# EAGLE design zigduino-v4 (EAGLE 5.10)
BOM: INCLUDE; COLOR: RED; DNP: T; PARTNO: 961206-6404-AR; VOLT: 40V
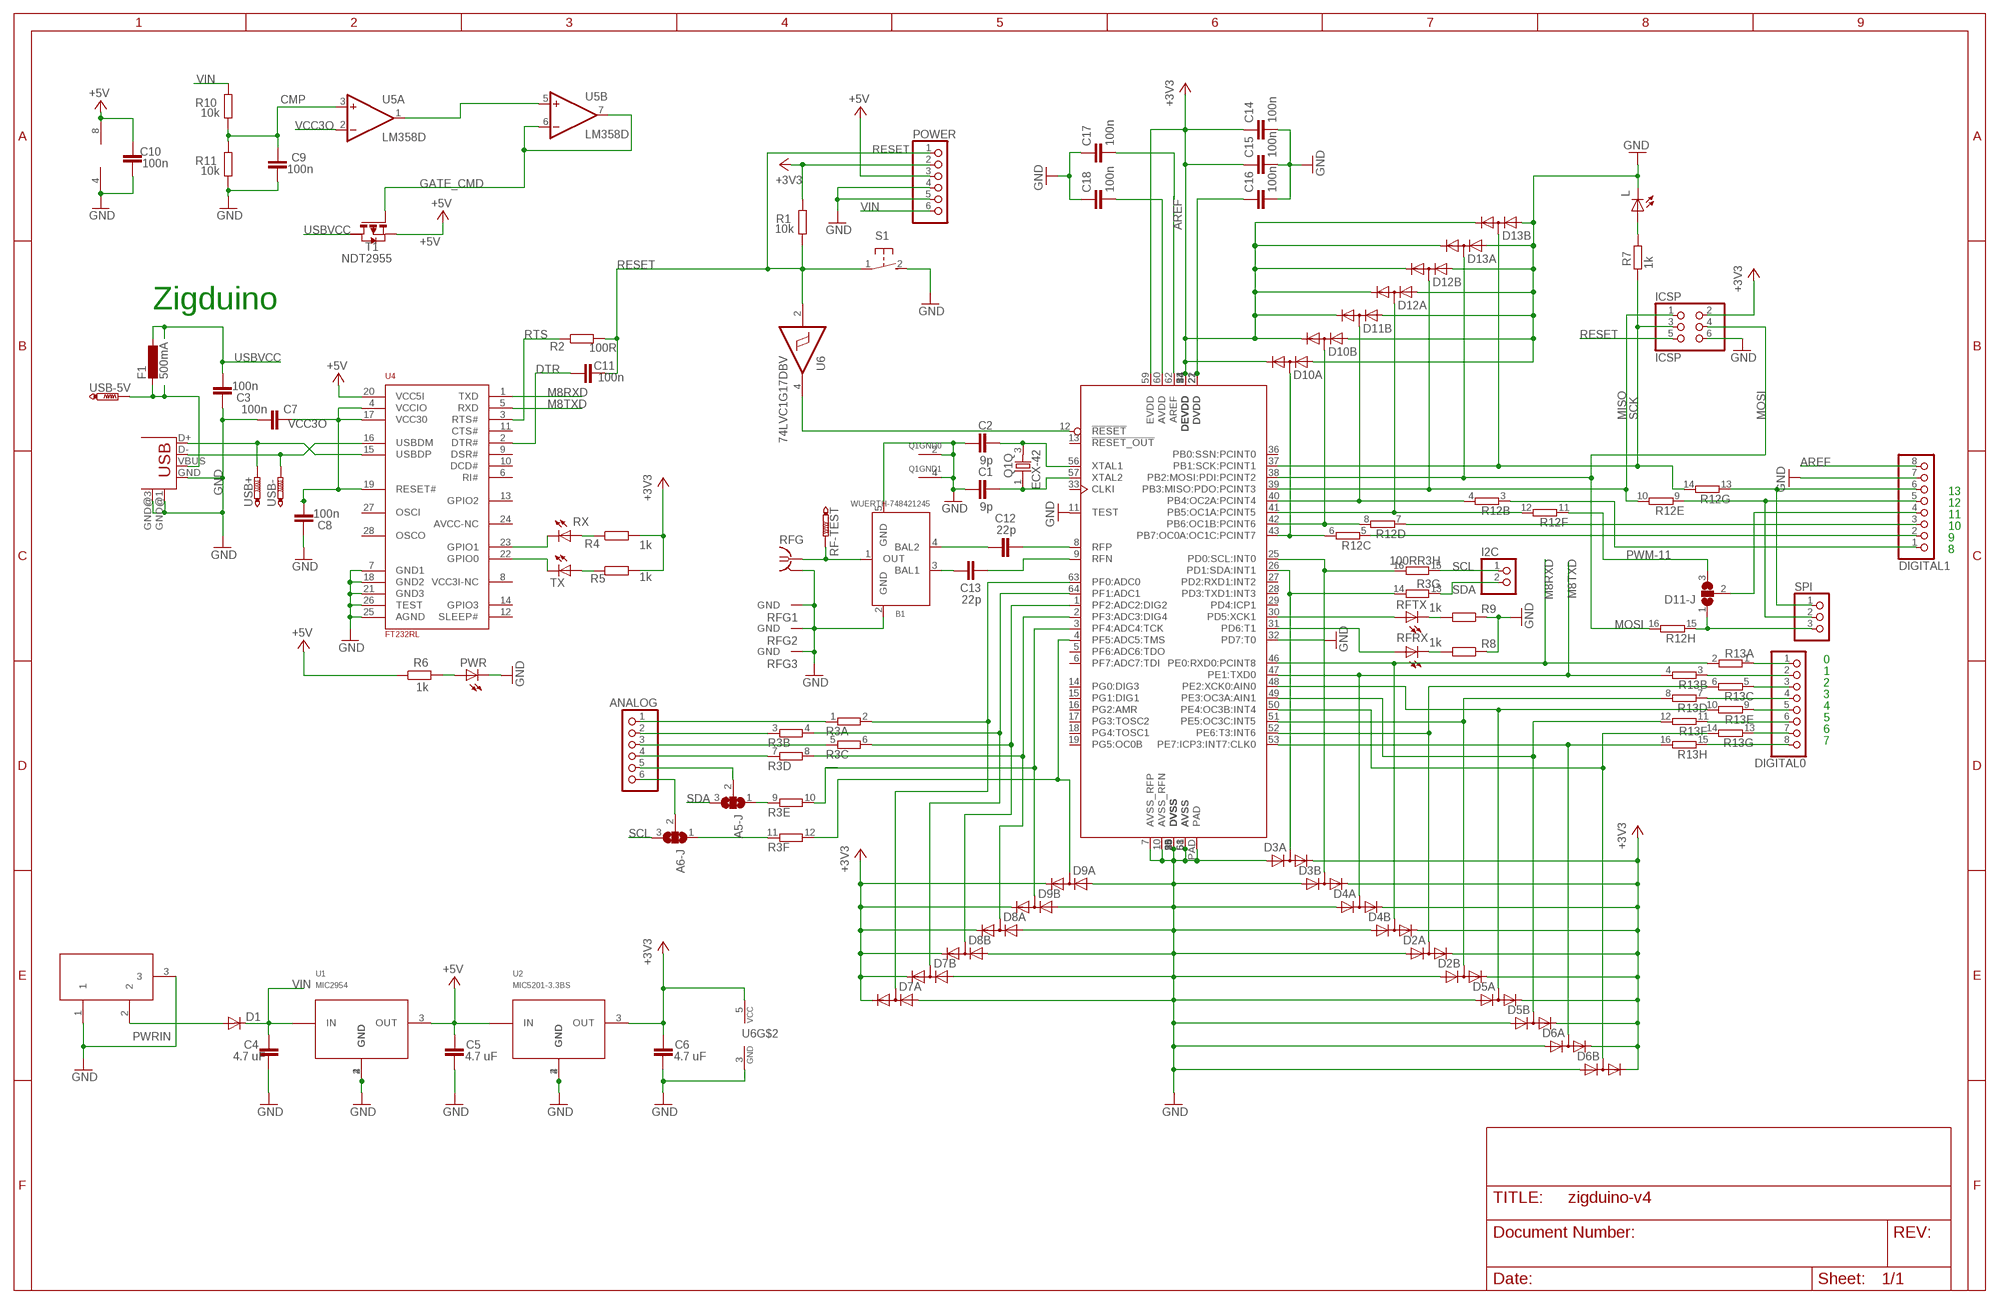
[diagram p0: schematic, sheet 1]

## Parts
A5-J  SJ2W  [SJ_2]
A6-J  SJ2W  [SJ_2]
ANALOG  PINHD-1X6  [1X06]
B1  WUERTH-748421245  [WURTH-BALUN]
C1  9p  C-EUC0603  [C0603]
C2  9p  C-EUC0603  [C0603]
C3  100n  C-EUC0603  [C0603]
C4  4.7 uF  C-EUC1206  [C1206]
C5  4.7 uF  C-EUC1206  [C1206]
C6  4.7 uF  C-EUC1206  [C1206]
C7  100n  C-EUC0603  [C0603]
C8  100n  C-EUC0603  [C0603]
C9  100n  C-EUC0603  [C0603]
C10  100n  C-EUC0603  [C0603]
C11  100n  C-EUC0603  [C0603]
C12  22p  C-EUC0603  [C0603]
C13  22p  C-EUC0603  [C0603]
C14  100n  C-EUC0603  [C0603]
C15  100n  C-EUC0603  [C0603]
C16  100n  C-EUC0603  [C0603]
C17  100n  C-EUC0603  [C0603]
C18  100n  C-EUC0603  [C0603]
D1  DIODE-SMB  [SMB]
D2  SD103ASDM  [SOT26]
D3  SD103ASDM  [SOT26]
D4  SD103ASDM  [SOT26]
D5  SD103ASDM  [SOT26]
D6  SD103ASDM  [SOT26]
D7  SD103ASDM  [SOT26]
D8  SD103ASDM  [SOT26]
D9  SD103ASDM  [SOT26]
D10  SD103ASDM  [SOT26]
D11  SD103ASDM  [SOT26]
D11-J  SJ2W  [SJ_2]
D12  SD103ASDM  [SOT26]
D13  SD103ASDM  [SOT26]
DC-PWR  DC21MMX  [DC-21MM]
DIGITAL0  PINHD-1X8  [1X08]
DIGITAL1  PINHD-1X8  [1X08]
F1  500mA  L-EUL1812  [L1812]
I2C  PINHD-1X2  [1X02]
ICSP  ICSP  PINHD-2X3  [2X03]
L  LEDCHIP-LED0603  [CHIP-LED0603]
POWER  PINHD-1X6  [1X06]
PWR  LEDCHIP-LED0603  [CHIP-LED0603]
Q1  ECX-42  [ECX-42]
R1  10k  R-EU_R0603  [R0603]
R2  100R  R-EU_R0603  [R0603]
R3  100R  8R-NCTS742C163  [CTS742C163-RES]
R4  1k  R-EU_R0603  [R0603]
R5  1k  R-EU_R0603  [R0603]
R6  1k  R-EU_R0603  [R0603]
R7  1k  R-EU_R0603  [R0603]
R8  1k  R-EU_R0603  [R0603]
R9  1k  R-EU_R0603  [R0603]
R10  10k  R-EU_R0603  [R0603]
R11  10k  R-EU_R0603  [R0603]
R12  100R  8R-NCTS742C163  [CTS742C163-RES]
R13  100R  8R-NCTS742C163  [CTS742C163-RES]
RF  CONNREVSMA003.062  [EDGE-RSMA]
RF-TEST  PTR1TP13SQ  [TP13SQ]
RFRX  LEDCHIP-LED0603  [CHIP-LED0603]
RFTX  LEDCHIP-LED0603  [CHIP-LED0603]
RX  LEDCHIP-LED0603  [CHIP-LED0603]
S1  B3U-1000  [B3U]
SPI  PINHD-1X3  [1X03]
T1  NDT2955  PMOSSOT223  [SOT223]
TX  LEDCHIP-LED0603  [CHIP-LED0603]
U1  MIC2954  [SOT223]
U2  MIC5201-3.3BS  [SOT223]
U3  ATMEGA128RFA1  [QFN64]
U4  FT232RL  [SSOP28]
U5  LM358D  [SO08]
U6  74LVC1G17DBV  [SOT23-5]
USB  USB-MB-S  [USB-MB-S]
USB+  PTR1TP13SQ  [TP13SQ]
USB-  PTR1TP13SQ  [TP13SQ]
USB-5V  PTR1TP13SQ  [TP13SQ]

## Nets
+3V3: C6.1 C14.1 C15.1 D2.2(A:C) D2.5(B:C) D3.2(A:C) D3.5(B:C) D4.2(A:C) D4.5(B:C) D5.2(A:C) D5.5(B:C) D6.2(A:C) D6.5(B:C) D7.2(A:C) D7.5(B:C) D8.2(A:C) D8.5(B:C) D9.2(A:C) D9.5(B:C) D10.2(A:C) D10.5(B:C) D11.5(B:C) D12.2(A:C) D12.5(B:C) D13.2(A:C) D13.5(B:C) ICSP.2 POWER.2 R1.2 R4.2 R5.2 U2.3(OUT) U3.23(DEVDD) U3.34(DEVDD) U3.44(DEVDD) U3.54(DEVDD) U3.59(EVDD) U6.5(VCC)
+5V [usbvcc]: C5.1 C10.2 POWER.3 R6.1 T1.3(S) U1.3(OUT) U2.1(IN) U4.20(VCC5I) U5.8(P:V+)
AREF [aref]: C17.2 DIGITAL1.8 U3.62(AREF)
CMP: C9.2 R10.1 R11.2 U5.3(A:+IN)
DTR: C11.1 U4.2(DTR#)
GATE_CMD: T1.1(G) U5.6(B:-IN) U5.7(B:OUT)
GND [gnd]: B1.2(GND) B1.5(GND) C1.1 C2.1 C3.2 C4.2 C5.2 C6.2 C7.1 C8.2 C9.1 C10.1 C14.2 C15.2 C16.2 C17.1 C18.1 D2.3(A:A) D2.6(B:A) D3.3(A:A) D3.6(B:A) D4.3(A:A) D4.6(B:A) D5.3(A:A) D5.6(B:A) D6.3(A:A) D6.6(B:A) D7.3(A:A) D7.6(B:A) D8.3(A:A) D8.6(B:A) D9.3(A:A) D9.6(B:A) D10.3(A:A) D10.6(B:A) D11.6(B:A) D12.3(A:A) D12.6(B:A) D13.3(A:A) D13.6(B:A) DC-PWR.1 DC-PWR.3 DIGITAL1.7 ICSP.6 L.C POWER.4 POWER.5 PWR.C Q1.2(GND0:PIN) Q1.4(GND1:PIN) R8.1 R9.1 R11.1 RF.SHIELD@0(G:GND) RF.SHIELD@1(GND) RF.SHIELD@2(GND) RF.SHIELD@3(GND) S1.2 U1.2(GND) U1.4(GND) U2.2(GND) U2.4(GND) U3.7(AVSS_RFP) U3.10(AVSS_RFN) U3.11(TEST) U3.20(DVSS) U3.24(DVSS) U3.32(PD7:T0) U3.35(DVSS) U3.45(DVSS) U3.55(DVSS) U3.58(AVSS) U3.61(AVSS) U3.PAD U4.7(GND1) U4.18(GND2) U4.21(GND3) U4.25(AGND) U4.26(TEST) U5.4(P:V-) U6.3(GND) USB.GND USB.GND@1(GND) USB.GND@3(GND)
M8RXD: D4.1(B:AC) R13.2 U3.46(PE0:RXD0:PCINT8) U4.1(TXD)
M8TXD: D4.4(A:AC) R13.4 U3.47(PE1:TXD0) U4.5(RXD)
MISO: D12.1(B:AC) ICSP.1 R12.10 U3.39(PB3:MISO:PDO:PCINT3)
MOSI: D13.4(A:AC) ICSP.4 R12.16 U3.38(PB2:MOSI:PDI:PCINT2)
MOSI-PIN: D11-J.1 R12.15 SPI.3
N$1: R9.2 RFTX.C
N$2: L.A R7.1
N$3: PWR.A R6.2
N$4 [rf]: B1.4(BAL2) C12.1
N$5: DIGITAL0.3 R13.5
N$6: C1.2 Q1.1 U3.57(XTAL2)
N$7: C2.2 Q1.3 U3.56(XTAL1)
N$8 [usbvcc]: F1.2 USB-5V.TP USB.VBUS
N$9 [rf]: B1.3(BAL1) C13.1
N$10: DIGITAL1.5 R12.9 SPI.2
N$11: DIGITAL0.5 R13.9
N$12: DIGITAL0.7 R13.13
N$13: DIGITAL0.6 R13.11
N$14: DIGITAL0.4 R13.7
N$15: DIGITAL0.8 R13.15
N$16: D3.1(B:AC) R3.16 U3.25(PD0:SCL:INT0)
N$17: D3.4(A:AC) R3.14 U3.26(PD1:SDA:INT1)
N$18 [gnd]: B1.1(OUT) RF-TEST.TP RF.CENTER
N$19: D12.4(A:AC) R12.12 U3.41(PB5:OC1A:PCINT5)
N$20: R8.2 RFRX.C
N$21: D2.4(A:AC) R13.6 U3.52(PE6:T3:INT6)
N$22: D2.1(B:AC) R13.8 U3.51(PE5:OC3C:INT5)
N$23 [rf]: C12.2 U3.8(RFP)
N$24 [rf]: C13.2 U3.9(RFN)
N$25: DIGITAL1.6 R12.13 SPI.1
N$26: RFRX.A U3.31(PD6:T1)
N$27: RFTX.A U3.30(PD5:XCK1)
N$28: U5.1(A:OUT) U5.5(B:+IN)
N$29: U3.12(!RESET!) U6.4(O)
N$32: RX.C U4.23(GPIO1)
N$33: D11.1(B:AC) R12.4 U3.40(PB4:OC2A:PCINT4)
N$34: TX.C U4.22(GPIO0)
N$35: R4.1 RX.A
N$36: R5.1 TX.A
N$38: D10.1(B:AC) R12.8 U3.42(PB6:OC1B:PCINT6)
N$39: D10.4(A:AC) R12.6 U3.43(PB7:OC0A:OC1C:PCINT7)
N$40: D5.4(A:AC) R13.10 U3.48(PE2:XCK0:AIN0)
N$41: D6.1(B:AC) R13.14 U3.50(PE4:OC3B:INT4)
N$42: D5.1(B:AC) R13.12 U3.49(PE3:OC3A:AIN1)
N$43: D6.4(A:AC) R13.16 U3.53(PE7:ICP3:INT7:CLK0)
N$44: A5-J.1 R3.9
N$45: A6-J.1 R3.11
N$48: D7.4(A:AC) R3.2 U3.63(PF0:ADC0)
N$49: D7.1(B:AC) R3.4 U3.64(PF1:ADC1)
N$50: D8.1(B:AC) R3.6 U3.1(PF2:ADC2:DIG2)
N$51: D8.4(A:AC) R3.8 U3.2(PF3:ADC3:DIG4)
N$52: D9.1(B:AC) R3.10 U3.3(PF4:ADC4:TCK)
N$53: D9.4(A:AC) R3.12 U3.4(PF5:ADC5:TMS)
N$54: ANALOG.1 R3.1
N$55: ANALOG.2 R3.3
N$56: ANALOG.3 R3.5
N$57: ANALOG.4 R3.7
N$58: A5-J.2 ANALOG.5
N$59: A6-J.2 ANALOG.6
N$60: DIGITAL1.1 R12.3
N$61: D11-J.2 DIGITAL1.4
N$63: C16.1 U3.21(DVDD) U3.22(DVDD)
N$64: C18.2 U3.60(AVDD)
N$65: DIGITAL1.2 R12.5
N$66: U4.16(USBDM) USB-.TP USB.D-
N$67: U4.15(USBDP) USB+.TP USB.D+
N$68: DIGITAL0.1 R13.1
N$69: DIGITAL0.2 R13.3
PWM-10: DIGITAL1.3 R12.7
PWM-11: D11-J.3 R12.11
PWRIN [power]: D1.A DC-PWR.2
RESET: C11.2 ICSP.5 POWER.1 R1.1 R2.2 S1.1 U6.2(I)
RTS: R2.1 U4.3(RTS#)
SCK: D13.1(B:AC) ICSP.3 R7.2 R12.14 U3.37(PB1:SCK:PCINT1)
SCL: A6-J.3 I2C.1 R3.15
SDA: A5-J.3 I2C.2 R3.13
USBVCC [usbvcc]: C3.1 F1.1 T1.2(D)
VCC3O: C7.2 C8.1 U4.4(VCCIO) U4.17(VCC30) U4.19(RESET#) U5.2(A:-IN)
VIN [power]: C4.1 D1.C POWER.6 R10.2 U1.1(IN)
Unconnected: D11.2(A:C) D11.3(A:A) D11.4(A:AC) R12.1 R12.2 T1.4(D2) U3.5(PF6:ADC6:TDO) U3.6(PF7:ADC7:TDI) U3.13(!RESET_OUT!) U3.14(PG0:DIG3) U3.15(PG1:DIG1) U3.16(PG2:AMR) U3.17(PG3:TOSC2) U3.18(PG4:TOSC1) U3.19(PG5:OC0B) U3.27(PD2:RXD1:INT2) U3.28(PD3:TXD1:INT3) U3.29(PD4:ICP1) U3.33(CLKI) U3.36(PB0:SSN:PCINT0) U4.6(RI#) U4.8(VCC3I-NC) U4.9(DSR#) U4.10(DCD#) U4.11(CTS#) U4.12(SLEEP#) U4.13(GPIO2) U4.14(GPIO3) U4.24(AVCC-NC) U4.27(OSCI) U4.28(OSCO)

## Notes on the sheet
- Zigduino
- 13
- 12
- 11
- 10
- 9
- 8
- 0
- 1
- 2
- 3
- 4
- 5
- 6
- 7

## Library data of the parts
A5-J A6-J D11-J = jumper:SJ2W: SMD solder JUMPER
ANALOG POWER = pinhead:PINHD-1X6: PIN HEADER
B1 = atmega128rfa1:WUERTH-748421245: Recommended Balun for Atmega128RFA1
C1-C18 = resistor:C-EU: CAPACITOR, European symbol
D1 = diode:DIODE-: DIODE
D2-D13 = logos-diodes:SD103ASDM: Digikey SD103ASDM-FDICT-ND
DC-PWR = powersupply:DC21MM
DIGITAL0 DIGITAL1 = pinhead:PINHD-1X8: PIN HEADER
F1 = rcl:L-EU: INDUCTOR, European symbol
I2C = pinhead:PINHD-1X2: PIN HEADER
ICSP = pinhead:PINHD-2X3: PIN HEADER
L PWR RFRX RFTX RX TX = led:LED: LED OSRAM: - CHIPLED LG R971, LG N971, LY N971, LG Q971, LY Q971, LO R971, LY R971 LH N974, LH R974 LS Q976, LO Q976, LY Q976 LO Q996 - Hyper CHIPLED LW Q18S LB Q993, LB Q99A, LB R99A - SideLED LS A670, LO A670, LY A670, LG A670, LP A670 LB A673, LV A673, LT A673, LW A673 LH A674 LY A675 LS A676, LA A676, LO A676, LY A676, LW A676 LS A679, LY A679, LG A679 - Hyper Micro SIDELED® LS Y876, LA Y876, LO Y876, LY Y876 LT Y87S - SmartLED LW L88C, LW L88S LB L89C, LB L89S, LG L890 LS L89K, LO L89K, LY L89K LS L896, LA L896, LO L896, LY L896 - TOPLED LS T670, LO T670, LY T670, LG T670, LP T670 LSG T670, LSP T670, LSY T670, LOP T670, LYG T670 LG T671, LOG T671, LSG T671 LB T673, LV T673, LT T673, LW T673 LH T674 LS T676, LA T676, LO T676, LY T676, LB T676, LH T676, LSB T676, LW T676 LB T67C, LV T67C, LT T67C, LS T67K, LO T67K, LY T67K, LW E67C LS E67B, LA E67B, LO E67B, LY E67B, LB E67C, LV E67C, LT E67C LW T67C LS T679, LY T679, LG T679 LS T770, LO T770, LY T770, LG T770, LP T770 LB T773, LV T773, LT T773, LW T773 LH T774 LS E675, LA E675, LY E675, LS T675 LS T776, LA T776, LO T776, LY T776, LB T776 LHGB T686 LT T68C, LB T68C - Hyper Mini TOPLED® LB M676 - Mini TOPLED Santana® LG M470 LS M47K, LO M47K, LY M47K Source: http://www.osram.convergy.de LUXEON: - LUMILED® LXK2-PW12-R00, LXK2-PW12-S00, LXK2-PW14-U00, LXK2-PW14-V00 LXK2-PM12-R00, LXK2-PM12-S00, LXK2-PM14-U00 LXK2-PE12-Q00, LXK2-PE12-R00, LXK2-PE12-S00, LXK2-PE14-T00, LXK2-PE14-U00 LXK2-PB12-K00, LXK2-PB12-L00, LXK2-PB12-M00, LXK2-PB14-N00, LXK2-PB14-P00, LXK2-PB14-Q00 LXK2-PR12-L00, LXK2-PR12-M00, LXK2-PR14-Q00, LXK2-PR14-R00 LXK2-PD12-Q00, LXK2-PD12-R00, LXK2-PD12-S00 LXK2-PH12-R00, LXK2-PH12-S00 LXK2-PL12-P00, LXK2-PL12-Q00, LXK2-PL12-R00 Source: www.luxeon.com KINGBRIGHT: KA-3528ASYC Source: www.kingbright.com
Q1 = atmega128rfa1:ECX-42
R1 R2 R4-R11 = resistor:R-EU_: RESISTOR, European symbol
R3 R12 R13 = res-cap-arrays:8R-N
RF = atmega128rfa1:CONNREVSMA: Reverse SMA connector
RF-TEST USB+ USB- USB-5V = testpad:PTR1: TEST PIN
S1 = logos-faves:B3U-1000: Omron B3U-1000 SMD tact switch
SPI = pinhead:PINHD-1X3: PIN HEADER
T1 = zetex:PMOSSOT223: MOS FET
U1 = logos-faves:MIC2954: 5V 250mA regulator
U2 = logos-faves:MIC5201: 200 mA 3.3V LDO linear regulator
U3 = atmega128rfa1:ATMEGA128RFA1: Atmega128RFA1 -- Atmega128 with Zigbee
U4 = SmartPrj:FT232RL
U5 = linear:LM358: OP AMP also LM158; LM258; LM2904 Source: http://cache.national.com/ds/LM/LM158.pdf
U6 = 74xx-little-us:74*1G17: Single Schmitt-Trigger Buffer
USB = con-usb-2:USB: USB Connectors

## Net classes
1 power: width 0.305 mm, drill 0.381 mm
2 gnd: width 0.305 mm, drill 0.381 mm
3 usbvcc: width 0.305 mm, drill 0.381 mm
4 aref: width 0.305 mm
5 rf: width 0.305 mm

## Board
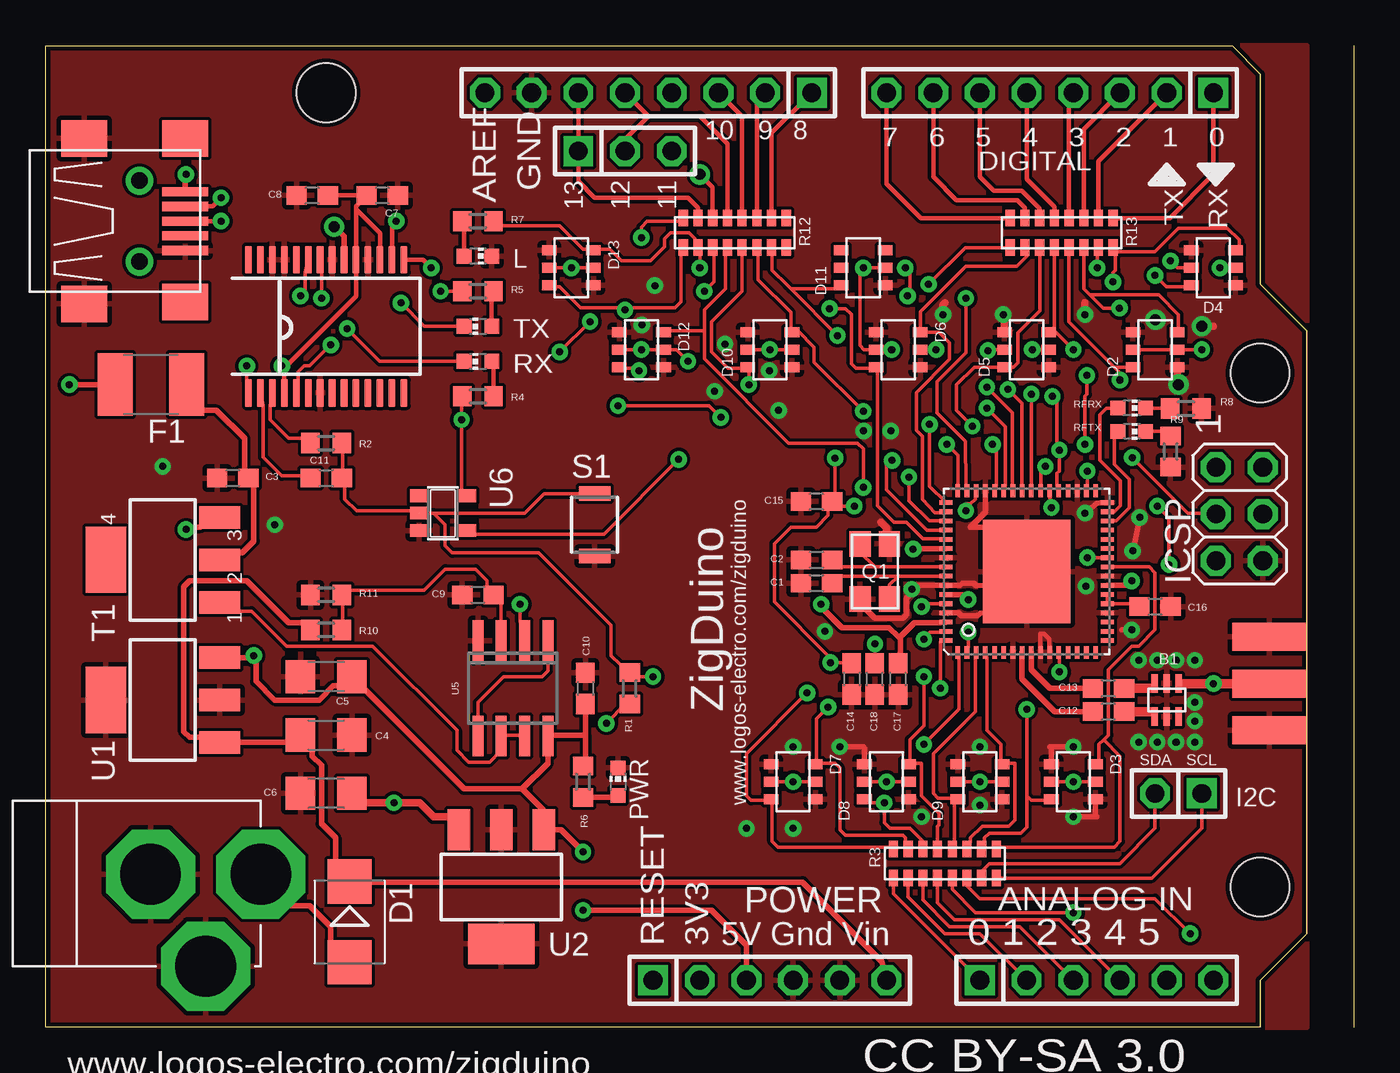
[diagram p1: board, top side]
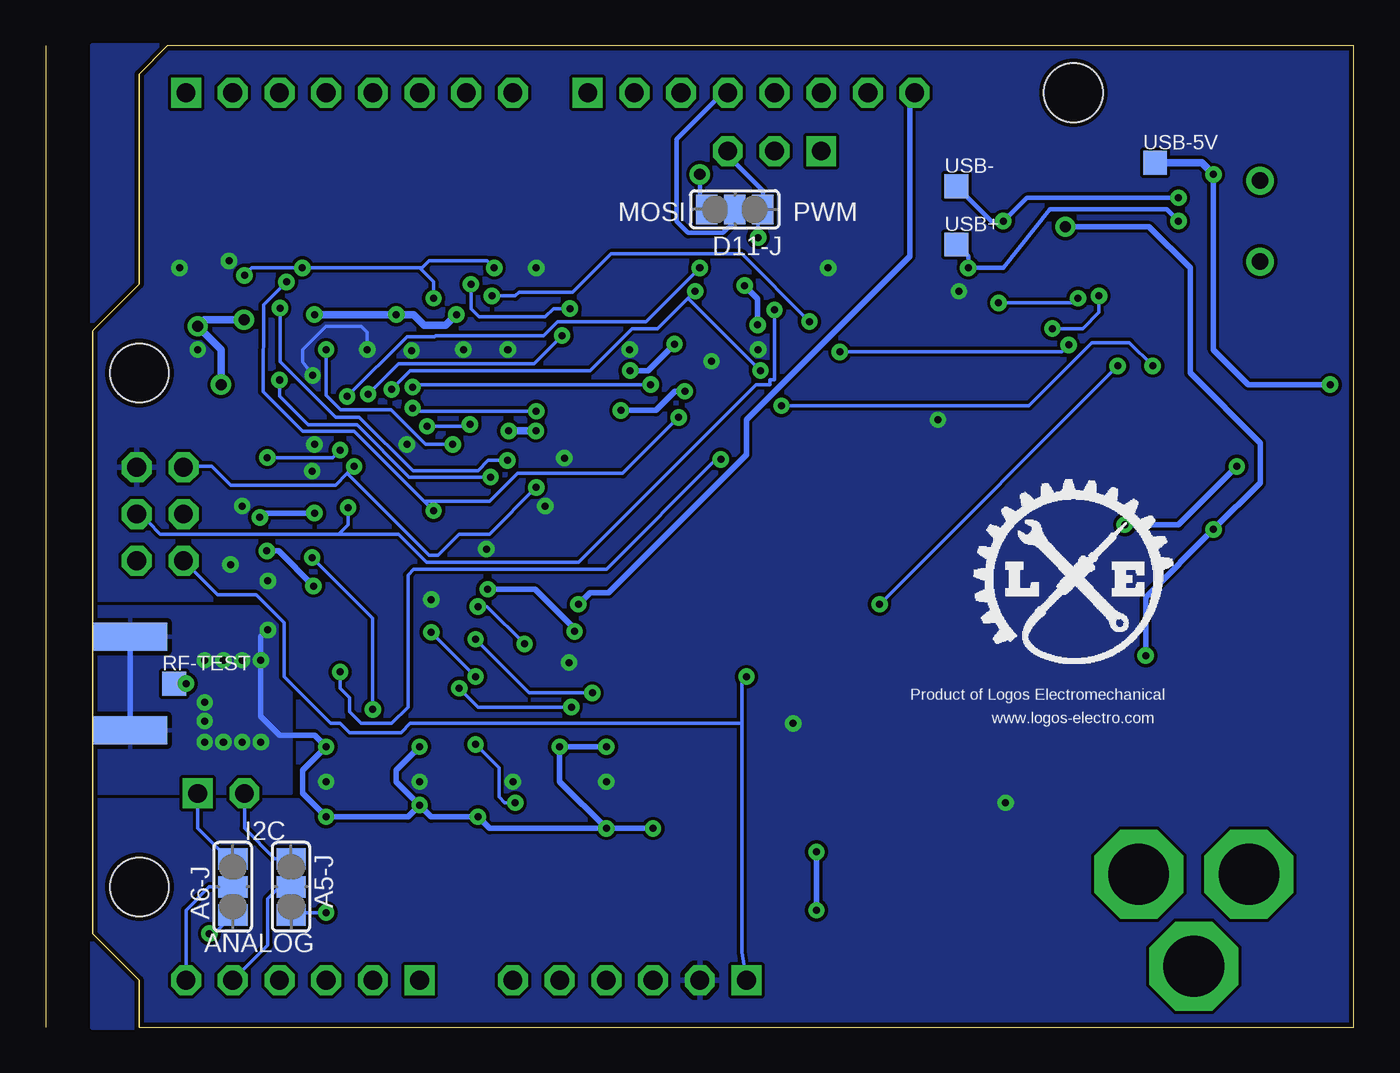
[diagram p2: board, bottom side, seen from below]

Size 71.12 x 53.34 mm. Coordinates in mm from the lower left corner, seen from the top.
Outline: 71.12,53.34 71.12,0
Outline: 0,53.34 64.52,53.34 66.04,51.82 66.04,40.39 68.58,37.85 68.58,5.08 66.04,2.54 66.04,0 0,0 0,53.34
Copper layers (1*16): Top 0.0356mm / dielectric 1.5011mm / Bottom 0.0356mm
Design rules "hbl-panel-7mil *": minimum track width 7mil, minimum drill 15mil, track to track 7mil, track to pad 7mil, pad to pad 7mil, via to via 7mil, smd to smd 0mil, copper to edge 10mil, drill to drill 8mil, minimum pad ring 12mil, minimum via ring 10mil, stop-mask expansion 0mil, vias tented up to drill 50mil, thermal gap 10mil
Holes 3.2 mm at 66.04,35.56 66.04,7.62 15.24,50.8
Milling: 6 lines

### Footprints (pad centres in the part's own frame; a part is rotated, then mirrored left to right if it is on the bottom)
SJ_2 = smd 1.168 x 1.6: 1 -1.524,0; 2 0,0; 3 1.524,0
1X06 = drill 1.016 square: 1 -6.35,0 | drill 1.016 octagon: 2 -3.81,0; 3 -1.27,0; 4 1.27,0; 5 3.81,0; 6 6.35,0
WURTH-BALUN = smd 0.35 x 1: 1 0.65,0.9; 2 0,0.9; 3 -0.65,0.9; 4 -0.65,-0.9; 5 0,-0.9; 6 0.65,-0.9
C0603 = smd 1.1 x 1: 1 -0.85,0; 2 0.85,0
C1206 = smd 1.6 x 1.8: 1 -1.4,0; 2 1.4,0
SMB = smd 2.4 x 2.4: A 2.2,0; C -2.2,0
SOT26 = smd 0.55 x 0.8: 1 -0.95,1.2; 2 0,1.2; 3 0.95,1.2; 4 0.95,-1.2; 5 0,-1.2; 6 -0.95,-1.2
DC-21MM = drill 3.302 pad 4.826 octagon: 1 -5.08,-3.353; 2 -0.076,-6.35; 3 -0.076,-0.356
1X08 = drill 1.016 square: 1 -8.89,0 | drill 1.016 octagon: 2 -6.35,0; 3 -3.81,0; 4 -1.27,0; 5 1.27,0; 6 3.81,0; 7 6.35,0; 8 8.89,0
L1812 = smd 1.9 x 3.4: 1 -1.95,0; 2 1.95,0
1X02 = drill 1.016 square: 1 -1.27,0 | drill 1.016 octagon: 2 1.27,0
2X03 = drill 1.016 octagon: 1 -2.54,-1.27; 2 -2.54,1.27; 3 0,-1.27; 4 0,1.27; 5 2.54,-1.27; 6 2.54,1.27
CHIP-LED0603 = smd 0.8 x 0.8: A 0,-0.75; C 0,0.75
ECX-42 = smd 1.4 x 1.15: 1 -1.5,-0.8; 2 1.5,-0.8; 3 1.5,0.8; 4 -1.5,0.8
R0603 = smd 1 x 1.1: 1 -0.85,0; 2 0.85,0
CTS742C163-RES = smd 0.9 x 0.5: 1 -0.8,2.8; 2 0.8,2.8; 3 -0.8,2; 4 0.8,2; 5 -0.8,1.2; 6 0.8,1.2; 7 -0.8,0.4; 8 0.8,0.4; 9 -0.8,-0.4; 10 0.8,-0.4; 11 -0.8,-1.2; 12 0.8,-1.2; 13 -0.8,-2; 14 0.8,-2; 15 -0.8,-2.8; 16 0.8,-2.8
EDGE-RSMA = smd 4.064 x 1.524: CENTER -2.032,0; SHIELD@0 -2.032,2.54; SHIELD@1 -2.032,-2.54 | smd 4.064 x 1.524 bottom: SHIELD@2 -2.032,2.54; SHIELD@3 -2.032,-2.54
TP13SQ = smd 1.3 x 1.3: TP 0,0
B3U = smd 0.8 x 1.7: 1 -1.7,0; 2 1.7,0
1X03 = drill 1.016 square: 1 -2.54,0 | drill 1.016 octagon: 2 0,0; 3 2.54,0
SOT223 = smd 1.219 x 2.235: 1 -2.311,-3.099; 2 0,-3.099; 3 2.311,-3.099 | smd 3.6 x 2.2: 4 0,3.099
QFN64 = smd 0.7 x 0.25: 1 -4.4,3.75; 2 -4.4,3.25; 3 -4.4,2.75; 4 -4.4,2.25; 5 -4.4,1.75; 6 -4.4,1.25; 7 -4.4,0.75; 8 -4.4,0.25; 9 -4.4,-0.25; 10 -4.4,-0.75; 11 -4.4,-1.25; 12 -4.4,-1.75; 13 -4.4,-2.25; 14 -4.4,-2.75; 15 -4.4,-3.25; 16 -4.4,-3.75; 33 4.4,-3.75; 34 4.4,-3.25; 35 4.4,-2.75; 36 4.4,-2.25; 37 4.4,-1.75; 38 4.4,-1.25; 39 4.4,-0.75; 40 4.4,-0.25; 41 4.4,0.25; 42 4.4,0.75; 43 4.4,1.25; 44 4.4,1.75; 45 4.4,2.25; 46 4.4,2.75; 47 4.4,3.25; 48 4.4,3.75 | smd 0.25 x 0.7: 17 -3.75,-4.4; 18 -3.25,-4.4; 19 -2.75,-4.4; 20 -2.25,-4.4; 21 -1.75,-4.4; 22 -1.25,-4.4; 23 -0.75,-4.4; 24 -0.25,-4.4; 25 0.25,-4.4; 26 0.75,-4.4; 27 1.25,-4.4; 28 1.75,-4.4; 29 2.25,-4.4; 30 2.75,-4.4; 31 3.25,-4.4; 32 3.75,-4.4; 49 3.75,4.4; 50 3.25,4.4; 51 2.75,4.4; 52 2.25,4.4; 53 1.75,4.4; 54 1.25,4.4; 55 0.75,4.4; 56 0.25,4.4; 57 -0.25,4.4; 58 -0.75,4.4; 59 -1.25,4.4; 60 -1.75,4.4; 61 -2.25,4.4; 62 -2.75,4.4; 63 -3.25,4.4; 64 -3.75,4.4 | smd 5.65 x 4.75: PAD 0,0
SSOP28 = smd 0.381 x 1.499: 1 -4.225,-3.625; 2 -3.575,-3.625; 3 -2.925,-3.625; 4 -2.275,-3.625; 5 -1.625,-3.625; 6 -0.975,-3.625; 7 -0.325,-3.625; 8 0.325,-3.625; 9 0.975,-3.625; 10 1.625,-3.625; 11 2.275,-3.625; 12 2.925,-3.625; 13 3.575,-3.625; 14 4.225,-3.625; 15 4.225,3.625; 16 3.575,3.625; 17 2.925,3.625; 18 2.275,3.625; 19 1.625,3.625; 20 0.975,3.625; 21 0.325,3.625; 22 -0.325,3.625; 23 -0.975,3.625; 24 -1.625,3.625; 25 -2.275,3.625; 26 -2.925,3.625; 27 -3.575,3.625; 28 -4.225,3.625
SO08 = smd 0.6 x 2.2: 1 -1.905,-2.6; 2 -0.635,-2.6; 3 0.635,-2.6; 4 1.905,-2.6; 5 1.905,2.6; 6 0.635,2.6; 7 -0.635,2.6; 8 -1.905,2.6
SOT23-5 = smd 0.69 x 0.99: 1 -0.95,-1.29; 2 0,-1.29; 3 0.95,-1.29; 4 0.95,1.3; 5 -0.95,1.3
USB-MB-S = smd 2.5 x 0.5: D+ 2.5,0; D- 2.5,0.8; GND 2.5,-1.6; ID 2.5,-0.8; VBUS 2.5,1.6 | smd 2.5 x 2: GND@1 -3,4.5; GND@2 2.5,4.5; GND@3 -3,-4.5; GND@4 2.5,-4.4 | drill 0.9 round: P$5 0,2.2; P$6 0,-2.2

### Placement (x,y rotation side)
A5-J  57.78,7.62 90 bottom
A6-J  60.96,7.62 90 bottom
ANALOG  57.15,2.54 0 top
B1  60.96,17.78 0 top
C1  41.91,24.13 0 top
C2  41.91,25.4 0 top
C3  10.16,29.84 180 top
C4  15.24,15.88 0 top
C5  15.24,19.05 180 top
C6  15.24,12.7 180 top
C7  18.29,45.21 180 top
C8  14.48,45.21 180 top
C9  23.5,23.5 0 top
C10  29.34,18.41 270 top
C11  15.24,29.84 0 top
C12  57.78,17.14 180 top
C13  57.78,18.41 180 top
C14  43.81,18.92 270 top
C15  41.91,28.57 180 top
C16  60.33,22.86 0 top
C17  46.35,18.92 90 top
C18  45.09,18.92 90 top
D1  16.51,5.71 270 top
D2  60.33,36.83 90 top
D3  55.88,13.34 270 top
D4  63.5,41.27 270 top
D5  53.34,36.83 90 top
D6  46.35,36.83 270 top
D7  40.64,13.34 270 top
D8  45.72,13.34 90 top
D9  50.8,13.34 90 top
D10  39.37,36.83 90 top
D11  44.45,41.27 90 top
D11-J  33.66,44.45 180 bottom
D12  32.38,36.83 270 top
D13  28.57,41.27 270 top
DC-PWR  5.33,8.38 90 top
DIGITAL0  54.61,50.8 180 top
DIGITAL1  32.77,50.8 180 top
F1  5.71,34.92 180 top
I2C  61.59,12.7 180 top
ICSP  64.91,27.89 270 top
L  23.5,41.91 270 top
POWER  39.37,2.54 0 top
PWR  31.11,13.34 0 top
Q1  45.09,24.77 90 top
R1  31.75,18.41 270 top
R2  15.24,31.75 0 top
R3  48.9,8.89 90 top
R4  23.5,34.29 180 top
R5  23.5,40.01 180 top
R6  29.21,13.34 270 top
R7  23.5,43.81 0 top
R8  62,33.63 180 top
R9  61.16,31.29 90 top
R10  15.24,21.59 180 top
R11  15.24,23.5 0 top
R12  37.47,43.18 270 top
R13  55.24,43.18 270 top
RF  68.58,18.67 0 top
RF-TEST  64.14,18.67 0 bottom
RFRX  59.05,33.66 270 top
RFTX  59.05,32.38 270 top
RX  23.5,36.2 90 top
S1  29.84,27.3 270 top
SPI  31.5,47.62 0 top
T1  6.35,25.4 90 top
TX  23.5,38.1 90 top
U1  6.35,17.78 90 top
U2  24.77,7.62 180 top
U3  53.34,24.77 90 top
U4  15.24,38.1 0 top
U5  25.4,18.41 180 top
U6  21.59,27.94 270 top
U$4  [LOGO-SM]  21.08,19.43 0 bottom
USB  5.08,43.81 0 top
USB+  21.59,42.55 0 bottom
USB-  21.59,45.72 0 bottom
USB-5V  10.79,46.99 0 bottom

### Tracks (layer width: path | path; a pad name or v marks a point on that pad's centre or on a via)
+3V3  (via drill 0.38)
  Top 0.178: 17.4,12.19 C6.1 | 21.97,11.43 U2.3 | R4.2 22.61,33.78 v22.61,33.02 22.61,29.21 U6.5 | R5.2 v21.46,40.01 | C14.1 43.43,19.81 v42.67,19.81 42.55,20.19 39.62,23.11 39.62,26.29 40.51,27.18 41.91,27.18 42.55,27.81 42.55,28.19 C15.1 | D3.5 v55.88,13.34 D3.2 | D9.2 v50.8,13.34 D9.5 | D8.2 v45.72,13.34 D8.5 | D7.5 v40.64,13.34 D7.2 | D11.5 v44.45,41.27 44.27,41.1 44.27,37.06 44.5,36.83 D6.5 v46,36.83 | D10.2 v39.37,36.83 D10.5 | D12.5 v32.38,36.83 D12.2 34.29,36.83 v34.92,36.2 | D13.5 v28.57,41.27 D13.2 | D4.2 v63.86,41.27 | v51.49,31.67 51.69,31.42 51.69,29.46 U3.44 | v56.64,30.23 56.64,29.46 U3.34 | v42.93,30.94 42.93,28.74 C15.1 | v43.97,28.32 43.01,28.32 C15.1 | R1.2 31.54,17.57 v30.48,16.51 | v61.09,25.15 61.09,27.69 v60.45,28.32 | D2.2 D2.5 v62.87,36.83 63.09,36.6 | D6.2 v48.41,36.83 | D5.2 51.28,36.83 v51.23,36.78 | v53.65,36.83 D5.5 | D4.5 61.54,41.27 v61.16,41.66 | v56.62,35.43 56.62,34.39 56.52,34.29 v56.52,31.67
  Top 0.305: U3.23 58.81,24.02 v59.05,24.26 | U3.59 49.89,23.52 v50.16,23.24 | U3.54 47.52,26.02 v47.17,25.98
  Top 0.406: 17.4,12.19 v18.92,12.19 20.32,12.19 21.08,11.43 21.97,11.43
  Bottom 0.178: v53.65,36.83 53.65,37.77 53.98,38.1 55.88,38.1 57.15,36.83 57.15,36.17 v56.62,35.43
  Bottom 0.305: v50.16,23.24 50.16,23.5 | v47.17,25.98 46.99,26.04
  pour Bottom (rank 3): 0,53.34 68.58,53.34 68.58,0 0,0
+5V  (via drill 0.38, 0.6)
  Top 0.305: 29.34,15.88 29.34,14.48 29.21,14.35 R6.1 | 29.34,15.88 C10.2 | 29.34,15.88 27.56,15.88 U5.8 27.3,14.35 25.91,12.95 | 11.3,20.07 11.43,20.07 11.43,18.8 12.45,17.78 14.86,17.78 15.62,18.54 15.88,18.54 C5.1 22.74,12.95 25.91,12.95 | 11.3,20.07 10.54,20.07 U1.3 | v7.62,27.05 7.62,27.18 8.38,27.18 T1.3 | 11.3,20.07 v11.3,20.19 | 25.91,12.95 27.08,11.79 U2.1 28.02,10.72 v29.21,9.53 | v29.21,6.35 36.2,6.35 38.1,4.45 POWER.3 | U4.20 16.21,42.99 v15.67,43.51
  Bottom 0.305: v11.3,20.19 11.3,23.37 v7.62,27.05 5.08,29.59 5.08,31.75 8.89,35.56 8.89,41.27 11.12,43.51 v15.67,43.51 | v29.21,9.53 v29.21,6.35
AREF  (via drill 0.38)
  Top 0.305: 46.48,21.21 47.24,21.97 48.64,21.97 U3.62 | 46.48,21.21 46.48,20.45 C17.2 | v42.16,22.99 42.16,22.86 43.31,21.72 45.85,21.72 46.35,21.21 46.48,21.21
  Bottom 0.305: v42.16,22.99 41.53,23.62 40.51,23.62 33.02,31.11 33.02,33.02 24.13,41.91 24.13,50.55 DIGITAL1.8
CMP
  Top 0.178: R10.1 16.13,22.1 16.13,22.99 R11.2 16.51,23.75 20.57,23.75 21.72,24.89 23.37,24.89 24,24.26 24,23.88 C9.2 24.77,23.11 U5.3
DTR
  Top 0.178: C11.1 13.84,29.97 12.83,29.97 11.81,30.99 11.81,33.78 U4.2
GATE_CMD
  Top 0.178: U5.7 25.78,15.88 25.02,15.88 U5.6 24.77,15.04 24.13,14.4 22.99,14.4 22.35,15.04 22.35,16.13 17.78,20.7 13.08,20.7 11.18,22.61 10.54,22.61 T1.1
GND  (via drill 0.38, 0.6)
  Top 0.254: U3.10 54.09,21.38 54.1,21.39 54.28,21.39 54.59,21.08 54.59,20.42 54.61,20.4
  Top 0.305: U3.45 51.09,27.98 50.29,27.18 51.94,27.18 52.07,27.3 52.07,26.04 U3.PAD | Q1.4 44.28,23.33 44.45,23.5 44.45,22.86 45.09,22.23 46.61,22.23 46.81,22.43 46.81,23.32 47.51,24.02 U3.58 49.72,24.02 49.84,24.13 50.47,24.13 50.6,24 51.32,24.02 | 51.32,24.02 51.44,24.13 | U3.61 49.62,22.52 49.78,22.35 50.67,22.35 50.83,22.5 51.73,22.52 52.07,22.86 52.07,23.5 U3.PAD | 51.32,24.02 52.59,24.02 U3.PAD | D8.3 44.52,15.17 44.45,15.24 v43.18,15.24 | D3.3 57.08,11.5 57.15,11.43 v55.88,11.43 | D3.6 54.68,15.17 54.61,15.24 v55.88,15.24 | U3.32 57.17,28.46 v56.52,27.94 | v59.49,27.71 59.13,25.91 v59.11,25.88 | v59.05,21.59 58.52,21.59
  Top 0.406: D2.6 61.52,34.99 v61.59,34.92 | v62.87,38.1 63.5,38.1 | v48.79,38.73 48.79,39.27 48.9,39.37 | D5.3 52.14,38.66 v52.07,38.73 | v56.52,38.73 56.52,39.37 | Q1.2 45.88,26.2 45.72,26.04 45.72,27.15 45.41,27.46
  Bottom 0.305: RF.SHIELD@3 RF.SHIELD@2 | v12.45,27.3 9.53,27.3 v6.35,30.48 | v38.1,10.79 v40.64,10.79 | v40.64,15.24 v43.18,15.24 43.18,13.34 v40.64,10.79 | v40.64,10.79 41.27,11.43 | v40.64,10.79 46.99,10.79 v47.62,11.43 50.16,11.43 v50.8,12.06 | v50.8,12.06 52.07,13.34 52.07,13.97 v50.8,15.24 | v50.8,12.06 51.44,11.43 v55.88,11.43 57.15,12.7 57.15,13.97 v55.88,15.24 56.52,15.88 58.42,15.88 59.44,16.89 v59.44,19.94 59.44,21.21 v59.05,21.59 | v42.37,21.51 42.37,21.64 44.53,23.8 v47.09,23.8 | v32.41,38.18 32.41,39.6 v33.12,40.31 | v39.34,35.69 38.38,35.69 v36.93,37.13 | v36.37,34.57 36.91,34.57 37.95,33.53 v39.85,33.53 | v59.11,25.88 58.47,25.88 v56.57,23.98 | v56.52,27.94 59.31,27.94 v59.49,27.71
  Bottom 0.406: v61.59,34.92 61.59,36.83 v62.87,38.1 62.51,38.46 v60.35,38.46 | v48.79,38.73 49.38,38.15 50.55,38.15 51.13,38.73 v52.07,38.73 v56.52,38.73 | v44.48,32.41 v45.95,32.41
  other vias: 60.45,19.94 62.48,19.94 62.48,17.65 62.48,15.49 62.48,16.64 61.47,19.94 61.47,15.49 60.45,15.49 59.44,15.49
  pour Top (rank 2): 0,53.34 68.58,53.34 68.58,0 0,0
  pour Bottom (rank 2): 68.58,22.86 57.78,22.86 57.78,12.7 68.58,12.7
M8RXD  (via drill 0.38)
  Top 0.178: v50.04,28.07 50.04,28.45 50.29,28.45 50.55,28.7 50.55,28.83 U3.46 | D4.1 64.39,42.29 64.9,42.29 64.9,42.8 64.26,43.43 61.59,43.43 60.33,42.16 58.29,42.16 R13.2 58.17,42.04 58.17,41.15 58.04,41.02 v58.04,40.51 | v10.92,35.94 10.92,35.18 U4.1 | v31.11,33.78 36.07,33.78 v36.7,33.15 36.83,33.02
  Bottom 0.178: 50.55,28.57 54.36,32.38 57.15,32.38 59.31,34.54 59.28,39.27 v58.04,40.51 | 50.55,28.57 v50.04,28.07 | v10.92,35.94 12.19,37.21 14.22,37.21 17.65,33.78 v31.11,33.78 | v36.7,33.15 39.75,30.1 45.47,30.1 46.99,28.57 50.55,28.57
M8TXD  (via drill 0.38)
  Top 0.178: v50.04,39.62 50.04,36.65 48.46,35.08 48.46,33.4 50.01,31.85 50.04,29.46 U3.47 | v57.17,41.27 57.17,42.04 R13.4 | v60.33,40.87 60.94,40.26 61.98,40.26 D4.4 | v15.49,37.08 14.35,35.94 14.03,35.94 13.72,35.62 13.72,35.18 U4.5 | v27.94,36.7 v29.59,38.35 | v46.86,39.75 46.99,39.88 46.99,41.02 v46.74,41.27
  Bottom 0.178: v60.33,40.87 60.2,41.15 60.07,41.15 59.94,41.27 v57.17,41.27 50.8,41.27 | v15.49,37.08 15.88,36.7 v27.94,36.7 | v29.59,38.35 33.27,42.04 40.39,42.04 42.47,39.95 45.39,39.95 45.59,39.75 v46.86,39.75 | v46.74,41.27 47.12,41.66 50.29,41.66 50.67,41.27 50.8,41.27 | v50.04,39.62 50.04,40.51 50.8,41.27
MISO  (via drill 0.38)
  Top 0.178: 35.81,37.85 33.91,37.85 D12.1 | 35.81,37.85 35.81,38.99 36.96,40.13 36.96,42.04 R12.10 | v54.36,30.48 54.1,30.23 54.1,29.46 U3.39 | 35.81,37.85 35.81,36.32 40.39,31.75 44.13,31.75 44.45,31.43 v44.45,29.34
  Bottom 0.178: 54.74,30.1 55.37,29.46 61.09,29.46 62.1,30.48 62.87,30.48 ICSP.1 | 54.74,30.1 v54.36,30.48 | v44.45,29.34 46.99,26.8 48.64,26.8 49.78,25.65 50.29,25.65 54.74,30.1
MOSI  (via drill 0.38)
  Top 0.178: 31.5,39.12 29.08,39.12 27.94,40.26 27.69,40.26 D13.4 | 31.5,39.12 34.23,39.12 34.54,39.43 34.54,42.04 R12.16 | 31.5,39.12 v31.5,38.99 | U3.38 54.59,28.34 v54.69,28.25
  Bottom 0.178: 55.19,26.8 51.94,26.8 50.42,25.27 42.16,25.27 32.51,34.92 31.75,34.92 31.75,35.18 31.5,35.18 v31.5,38.99 | 55.19,26.8 64.9,26.8 65.53,27.43 ICSP.4 | v54.69,28.25 54.69,27.3 55.19,26.8
MOSI-PIN  (via drill 0.38)
  Top 0.178: v32.38,42.93 32.38,43.5 32.7,43.81 34.42,43.81 R12.15
  Bottom 0.178: v32.38,42.93 32.38,43.69 D11-J.1
  Bottom 0.254: D11-J.1 32.13,45.47 34.04,47.37 SPI.3
N$1
  Top 0.178: RFTX.C 61.16,32.38 R9.2
N$2
  Top 0.254: R7.1 22.75,43.81 L.A
N$3
  Top 0.305: R6.2 31.02,12.48 PWR.A
N$4
  Top 0.305: 60.2,17.14 B1.4
  Top 0.508: C12.1 60.2,17.14
N$5
  Top 0.254: R13.5 56.45,48.83 DIGITAL0.3
N$6
  Top 0.178: 46.35,24.52 43.15,24.52 C1.2 | 46.35,24.52 U3.57 | Q1.1 45.88,24.05 46.35,24.52
N$7
  Top 0.178: 45.09,25.02 43.15,25.02 C2.2 | 45.09,25.02 U3.56 | Q1.3 44.28,25.82 45.09,25.02
N$8  (via drill 0.38)
  Top 0.305: USB.VBUS 7.58,46.31 v7.62,46.35 | v1.27,34.92 F1.2
  Bottom 0.305: v7.62,46.35 7.62,36.83 5.71,34.92 v1.27,34.92
  Bottom 0.406: USB-5V.TP 8.26,46.99 v7.62,46.35
N$9
  Top 0.305: 60.2,18.41 B1.3
  Top 0.508: C13.1 60.2,18.41
N$10
  Top 0.254: R12.9 37.06,48.02 35.56,49.53 32.77,49.53 | SPI.2 31.5,48.26 32.77,49.53 | 32.77,49.53 DIGITAL1.5
N$11
  Top 0.254: R13.9 54.84,44.6 53.34,46.1 DIGITAL0.5
N$12
  Top 0.254: R13.13 53.24,44.55 52.83,44.96 49.53,44.96 48.26,46.23 DIGITAL0.7
N$13
  Top 0.254: R13.11 54.05,44.51 53.09,45.47 51.56,45.47 50.8,46.23 DIGITAL0.6
N$14
  Top 0.254: R13.7 55.65,50.56 DIGITAL0.4
N$15
  Top 0.254: R13.15 47.59,43.98 45.72,45.85 DIGITAL0.8
N$16
  Top 0.178: 57.53,15.62 57.28,15.37 57.28,14.48 D3.1 | 57.53,15.62 57.78,15.88 57.78,19.43 59.05,20.7 59.44,20.7 60.33,21.59 60.33,24.7 60.01,25.02 58.04,25.02 U3.25 | 57.53,15.62 58.42,14.73 58.42,10.1 58.1,9.78 51.94,9.78 R3.16
N$17  (via drill 0.38)
  Top 0.178: v56.64,25.53 57.4,25.53 U3.26 | 53.34,12.57 v53.34,17.27 | 53.34,12.57 53.59,12.32 54.36,12.32 D3.4 | 53.34,12.57 53.34,10.86 53.02,10.54 51.31,10.54 51.05,10.29 51.05,10.03 R3.14
  Bottom 0.178: v56.64,25.53 53.34,22.23 v53.34,17.27
N$18  (via drill 0.38)
  Top 0.305: B1.1 61.72,18.67
  Top 0.508: 61.72,18.67 62.87,18.67 v63.5,18.67 RF.CENTER
  Bottom 0.508: v63.5,18.67 RF-TEST.TP
N$19  (via drill 0.38)
  Top 0.178: v52.32,34.67 53.09,33.91 53.09,29.46 U3.41 | v35.81,40.01 36.32,40.51 36.32,42.04 R12.12 | v32.26,35.69 32.26,35.81 31.5,35.81 D12.4
  Bottom 0.178: v52.32,34.67 51.31,35.69 41.53,35.69 39.24,37.97 37.85,37.97 36.2,39.62 | 36.2,39.62 v35.81,40.01 | v32.26,35.69 36.2,39.62
N$20
  Top 0.178: RFRX.C 61.15,33.66 R8.2
N$21  (via drill 0.38)
  Top 0.178: R13.6 56.45,40.15 56.77,39.8 | 56.77,39.8 60.53,39.8 61.59,38.73 61.59,37.85 D2.4 | U3.52 47.91,27.02 45.72,29.21 45.72,30.5 v46.02,30.81 | v58.4,39.09 57.51,39.09 56.77,39.8
  Bottom 0.178: v46.02,30.81 47.07,30.81 47.62,30.25 51.16,30.25 54.08,33.15 55.37,33.15 58.4,36.17 v58.4,39.09
N$22  (via drill 0.38)
  Top 0.178: 58.1,35.88 D2.1 | R13.8 55.65,38.34 58.1,35.88 | U3.51 48.05,27.52 46.94,28.63 v46.94,29.9 | v58.42,35.18 58.42,35.56 58.1,35.88
  Bottom 0.178: v46.94,29.9 51.36,29.9 54.2,32.74 56.87,32.74 58.42,34.29 v58.42,35.18
N$23
  Top 0.305: U3.8 53.09,20.07 53.09,18.92 54.86,17.14 C12.2
N$24
  Top 0.305: C13.2 54.61,18.41 53.59,19.43 U3.9
N$25
  Top 0.254: R12.13 35.47,44.55 34.92,45.09 29.84,45.09 28.96,45.97 SPI.1 DIGITAL1.6
N$26
  Top 0.178: U3.31 58.11,28.02 58.45,28.35 58.45,29.69 57.33,30.81 57.33,33.3 57.68,33.66 RFRX.A
N$27
  Top 0.178: U3.30 58.22,27.52 58.93,28.22 58.93,29.79 58.12,30.61 58.12,32.2 RFTX.A
N$28
  Top 0.178: U5.5 23.5,17.65 24.89,19.05 26.99,19.05 27.3,19.37 U5.1
N$29  (via drill 0.38)
  Top 0.178: v55.12,19.3 55.12,20.07 U3.12 | v34.42,30.86 30.35,26.8 22.73,26.8 22.73,26.83 U6.4
  Bottom 0.178: v55.12,19.3 55.12,18.41 54.61,17.91 54.61,17.14 53.98,16.51 52.32,16.51 51.44,17.4 51.44,24.57 51.12,24.89 40.64,24.89 34.67,30.86 v34.42,30.86
N$32  (via drill 0.38)
  Top 0.178: v16.38,37.97 18.16,36.2 RX.C | v13.84,39.75 14.1,40.01 14.1,41.02 U4.23
  Bottom 0.178: v13.84,39.75 13.84,38.86 14.73,37.97 v16.38,37.97
N$33  (via drill 0.38)
  Top 0.178: v53.59,34.42 53.59,29.46 U3.40 | D11.1 43.18,40.13 40.51,40.13 | R12.4 39.5,42.04 39.5,41.15 40.32,40.32 40.51,40.13 | v43.05,37.59 40.51,40.13
  Bottom 0.178: v53.59,34.42 51.94,36.07 44.58,36.07 v43.05,37.59
N$34  (via drill 0.38)
  Top 0.178: v19.3,39.37 20.57,38.1 TX.C | v14.99,39.62 14.99,41.02 U4.22
  Bottom 0.178: v19.3,39.37 15.24,39.37 v14.99,39.62
N$35
  Top 0.254: RX.A 24.34,36.2 R4.1
N$36
  Top 0.254: R5.1 24.25,40.01 TX.A
N$38  (via drill 0.38)
  Top 0.178: v51.18,34.8 52.58,33.4 52.58,29.46 U3.42 | v38.23,34.92 38.23,35.69 D10.1 37.85,35.81 37.08,35.81 36.2,36.7 36.2,38.35 37.85,40.01 37.85,42.04 R12.8
  Bottom 0.178: v51.18,34.8 51.05,34.92 v38.23,34.92
N$39  (via drill 0.38)
  Top 0.178: v51.18,33.66 52.2,32.64 52.2,29.46 U3.43 | v44.45,33.48 41.78,36.14 41.78,36.96 40.89,37.85 D10.4 40.51,37.97 40.51,38.86 38.73,40.64 38.73,42.04 R12.6
  Bottom 0.178: v51.18,33.66 51.36,33.48 v44.45,33.48
N$40  (via drill 0.38)
  Top 0.178: R13.10 54.84,38.09 D5.4 54.93,37.78 v55.88,36.83 | U3.48 49.59,31.08 v49,31.67
  Bottom 0.178: v49,31.67 50.47,31.67 52.35,33.55 55.09,33.55 55.88,34.34 v55.88,36.83
N$41
  Top 0.178: R13.14 53.34,42.28 53.34,41.91 52.81,41.38 50.04,41.38 47.55,38.89 D6.1 48.58,37.78 49.15,37.21 49.15,36.3 47.35,34.49 47.35,32.44 47.66,32.12 47.66,28.69 48.36,27.96 48.89,27.96 U3.50
N$42  (via drill 0.38)
  Top 0.178: R13.12 54.05,42.37 54.05,38.94 52.86,37.74 52.86,36.12 52.62,35.88 D5.1 50.48,35.88 49.53,34.92 49.53,33.53 v50.39,32.66 | v48.06,32.77 48.06,29.41 U3.49
  Bottom 0.178: v50.39,32.66 48.18,32.66 v48.06,32.77
N$43  (via drill 0.38)
  Top 0.178: U3.53 48.64,26.54 47.7,26.54 46.81,27.43 46.13,27.43 45.21,28.35 45.21,35.69 D6.4 44.83,35.81 44.07,35.81 43.81,36.07 43.81,38.75 43.5,39.06 v42.62,39.06 | R13.16 50,42.38 v48.01,40.39
  Bottom 0.178: v48.01,40.39 48.01,39.04 47.57,38.61 43.97,38.61 43.51,39.06 v42.62,39.06
N$44  (via drill 0.38)
  Top 0.178: R3.9 49.3,7.49 50.56,6.22 v55.88,6.22
  Bottom 0.178: v55.88,6.22 57.53,6.22 A5-J.1
N$45  (via drill 0.38)
  Top 0.178: R3.11 50.09,7.69 50.8,6.99 60.33,6.99 v62.23,5.08
  Bottom 0.178: v62.23,5.08 61.98,5.08 A6-J.1
N$48  (via drill 0.38)
  Top 0.178: v47.75,21.08 47.75,21.14 48.07,21.46 48.64,21.46 U3.63 | v41.4,18.16 38.1,14.86 38.1,12.57 38.35,12.32 39.12,12.32 D7.4 39.5,12.19 39.5,10.1 39.81,9.78 45.85,9.78 R3.2
  Bottom 0.178: v47.75,21.08 44.83,18.16 v41.4,18.16
N$49  (via drill 0.38)
  Top 0.178: v48.64,18.41 48.64,20.95 U3.64 | v42.55,17.4 41.91,16.76 41.91,14.48 D7.1 42.16,14.35 42.93,14.35 43.18,14.1 43.18,10.73 43.5,10.41 46.61,10.41 46.74,10.29 46.74,10.03 R3.4
  Bottom 0.178: v48.64,18.41 47.62,17.4 v42.55,17.4
N$50  (via drill 0.38)
  Top 0.178: v47.75,15.37 49.66,17.27 49.66,20.07 U3.1 | D8.1 44.83,12.19 v45.59,12.19 45.59,11.11 45.91,10.79 46.99,10.79 47.7,10.09 R3.6
  Bottom 0.178: v47.75,15.37 46.48,14.1 46.48,12.51 46.16,12.19 v45.59,12.19
N$51  (via drill 0.38)
  Top 0.178: v50.16,21.46 50.16,20.7 U3.2 | v47.75,19.05 47.75,16.38 46.99,15.62 46.99,14.48 D8.4 47.24,14.35 47.62,14.35 47.62,12.57 48.57,11.62 48.57,10.98 48.49,10.9 R3.8
  Bottom 0.178: v47.75,19.05 v50.16,21.46
N$52
  Top 0.178: U3.3 50.55,20.07 50.55,17.14 48.26,14.86 48.26,12.7 48.51,12.45 49.28,12.45 D9.1 49.4,12.19 49.4,10.03 R3.10
N$53
  Top 0.178: U3.4 51.18,20.07 51.18,16.13 51.94,15.37 51.94,14.48 D9.4 52.32,14.35 52.7,14.35 52.7,11.24 52.39,10.92 50.93,10.92 50.29,10.29 50.29,10.03 R3.12
N$54
  Top 0.178: R3.1 46.09,7.25 ANALOG.1
N$55
  Top 0.178: R3.3 46.9,7.08 48.9,5.08 50.8,5.08 ANALOG.2
N$56
  Top 0.178: R3.5 47.7,6.92 49.15,5.46 52.96,5.46 ANALOG.3
N$57
  Top 0.178: R3.7 48.49,6.75 49.4,5.84 55.12,5.84 ANALOG.4
N$58
  Bottom 0.178: A5-J.2 58.42,7.62 59.05,6.99 59.05,4.45 ANALOG.5
N$59
  Bottom 0.178: A6-J.2 62.23,7.62 63.5,6.35 ANALOG.6
N$60
  Top 0.254: R12.3 39.47,48.61 DIGITAL1.1
N$61
  Bottom 0.254: D11-J.2 33.66,43.81 34.29,43.18 36.2,43.18 36.83,43.81 36.83,48.26 34.29,50.8 DIGITAL1.4
N$63
  Top 0.178: U3.22 U3.21 59.32,23.02 C16.1
N$64  (via drill 0.38)
  Top 0.178: U3.60 47.78,23.02 v47.62,22.86 | C18.2 v45.09,20.83
  Bottom 0.178: v47.62,22.86 47.12,22.86 v45.09,20.83
N$65
  Top 0.254: R12.5 38.66,50.35 DIGITAL1.2
N$66  (via drill 0.38)
  Top 0.254: U4.16 18.82,43.58 v19.05,43.81 | USB.D- 9.05,44.62 v9.53,45.09
  Bottom 0.254: USB-.TP 19.68,43.81 v19.05,43.81 17.78,45.09 v9.53,45.09
N$67  (via drill 0.38)
  Top 0.254: U4.15 20.5,41.73 v20.95,41.27 | USB.D+ v9.53,43.81
  Bottom 0.254: USB+.TP 20.95,41.91 v20.95,41.27 19.05,41.27 16.51,44.45 10.16,44.45 v9.53,43.81
N$68
  Top 0.254: R13.1 61.12,43.98 63.5,46.35 DIGITAL0.1
N$69
  Top 0.254: R13.3 57.24,47.09 DIGITAL0.2
PWM-10
  Top 0.254: R12.7 37.87,49.51 DIGITAL1.3
PWM-11  (via drill 0.6)
  Top 0.254: R12.11 36.27,45.65 v35.56,46.35
  Bottom 0.254: v35.56,46.35 35.56,44.83 D11-J.3
PWRIN
  Top 0.305: D1.A 15.49,4.7 15.49,5.46 14.35,6.6 13.34,6.6 DC-PWR.2
RESET  (via drill 0.38)
  Top 0.178: R2.2 16.13,31.24 16.13,30.23 C11.2 16.26,29.46 16.26,28.7 16.89,28.07 19.81,28.07 U6.2 21.08,27.94 | 21.08,27.94 21.72,27.3 21.72,26.16 22.1,25.78 26.8,25.78 30.73,21.84 30.73,20.19 31.24,19.68 R1.1 32.26,19.05 v33.02,19.05 | 21.08,27.94 26.04,27.94 27.1,29 S1.1
  Bottom 0.178: 33.27,16.51 33.27,19.05 v33.02,19.05 | 33.27,16.51 33.27,4.06 POWER.1 | 33.27,16.51 51.31,16.51 51.82,16 54.61,16 55.12,16.51 55.63,16.51 58.17,19.05 58.17,21.97 59.69,23.5 61.78,23.5 ICSP.5
RTS
  Top 0.178: R2.1 13.97,32 13.21,32 12.19,33.02 12.19,33.78 U4.3
SCK  (via drill 0.38)
  Top 0.178: R7.2 24.77,43.56 27.94,43.56 29.21,42.29 29.46,42.29 D13.1 30.1,42.29 30.67,42.29 31.3,41.66 32.89,41.66 33.66,42.42 33.66,42.86 33.97,43.18 34.99,43.18 35.31,42.86 35.31,42.8 R12.14 35.56,42.04 v35.56,41.27 | v59.08,30.96 62.1,27.94 62.87,27.94 ICSP.3 | U3.37 54.99,29.46 54.99,30.1 55.12,30.23 v55.12,31.37 54.99,31.75 54.99,34.04 v54.74,34.29
  Bottom 0.178: v55.12,31.37 55.52,30.96 v59.08,30.96 | v35.56,41.27 38.48,38.35 43.31,38.35 44.07,37.59 49.94,37.59 49.99,37.54 51.49,37.54 v54.74,34.29
SCL
  Top 0.178: R3.15 60.16,8.09 62.87,10.79 I2C.1
  Bottom 0.178: A6-J.3 61.21,9.14 62.87,10.79 I2C.1
SDA
  Top 0.178: R3.13 50.9,8.48 51.31,8.89 58.42,8.89 60.33,10.79 I2C.2
  Bottom 0.178: A5-J.3 58.67,9.14 60.33,10.79 I2C.2
USBVCC
  Top 0.305: F1.1 8.51,33.53 9.27,33.53 10.79,32 10.79,30.23 C3.1 11.3,29.46 11.3,26.42 10.67,25.78 10.54,25.78 T1.2
VCC3O  (via drill 0.38)
  Top 0.178: v25.78,22.99 25.78,22.1 U5.2 | v12.83,35.94 12.95,35.94 12.96,35.83
  Top 0.254: C8.1 C7.2 16.86,44.64 16.86,44.45 | 16.86,44.45 U4.19 16.86,39.73 12.96,35.83 U4.4 | U4.17 18.16,43.15 16.86,44.45
  Bottom 0.178: v25.78,22.99 25.78,23.24 25.53,23.24 v12.83,35.94
VIN
  Top 0.305: R10.2 13.97,21.97 13.21,21.97 10.92,24.26 7.81,24.26 7.49,23.94 7.49,16.07 7.81,15.75 8.38,15.75 U1.1 10.54,15.49 13.08,15.49 C4.1 14.48,14.99 14.48,14.73 14.99,14.22 14.99,11.05 15.75,10.29 15.75,9.02 D1.C 17.65,7.87 41.15,7.87 45.47,3.56 POWER.6

### Text on the board
tPlace: SDA | SCL
tNames: 10 | 9 | 8 | 7 | 6 | 5 | 4 | 3 | 2 | 1 | 0 | DIGITAL | TX | RX | AREF | GND | 13 | 12 | 11 | TX | RX | 1 | ZigDuino | www.logos-electro.com/zigduino | ANALOG IN | RESET | 3V3 | 5V Gnd Vin | 0 1 2 3 4 5 | CC BY-SA 3.0 | www.logos-electro.com/zigduino
bNames: PWM | MOSI | Product of Logos Electromechanical | www.logos-electro.com | I2C | ANALOG
Reference: C8 | R7 | R5 | R6 | R4 | C3 | C2 | R9 | R8 | R1 | R2 | C1 | C4 | C5 | X2 | C7 | C6